# EAGLE board gator (EAGLE 6.3)
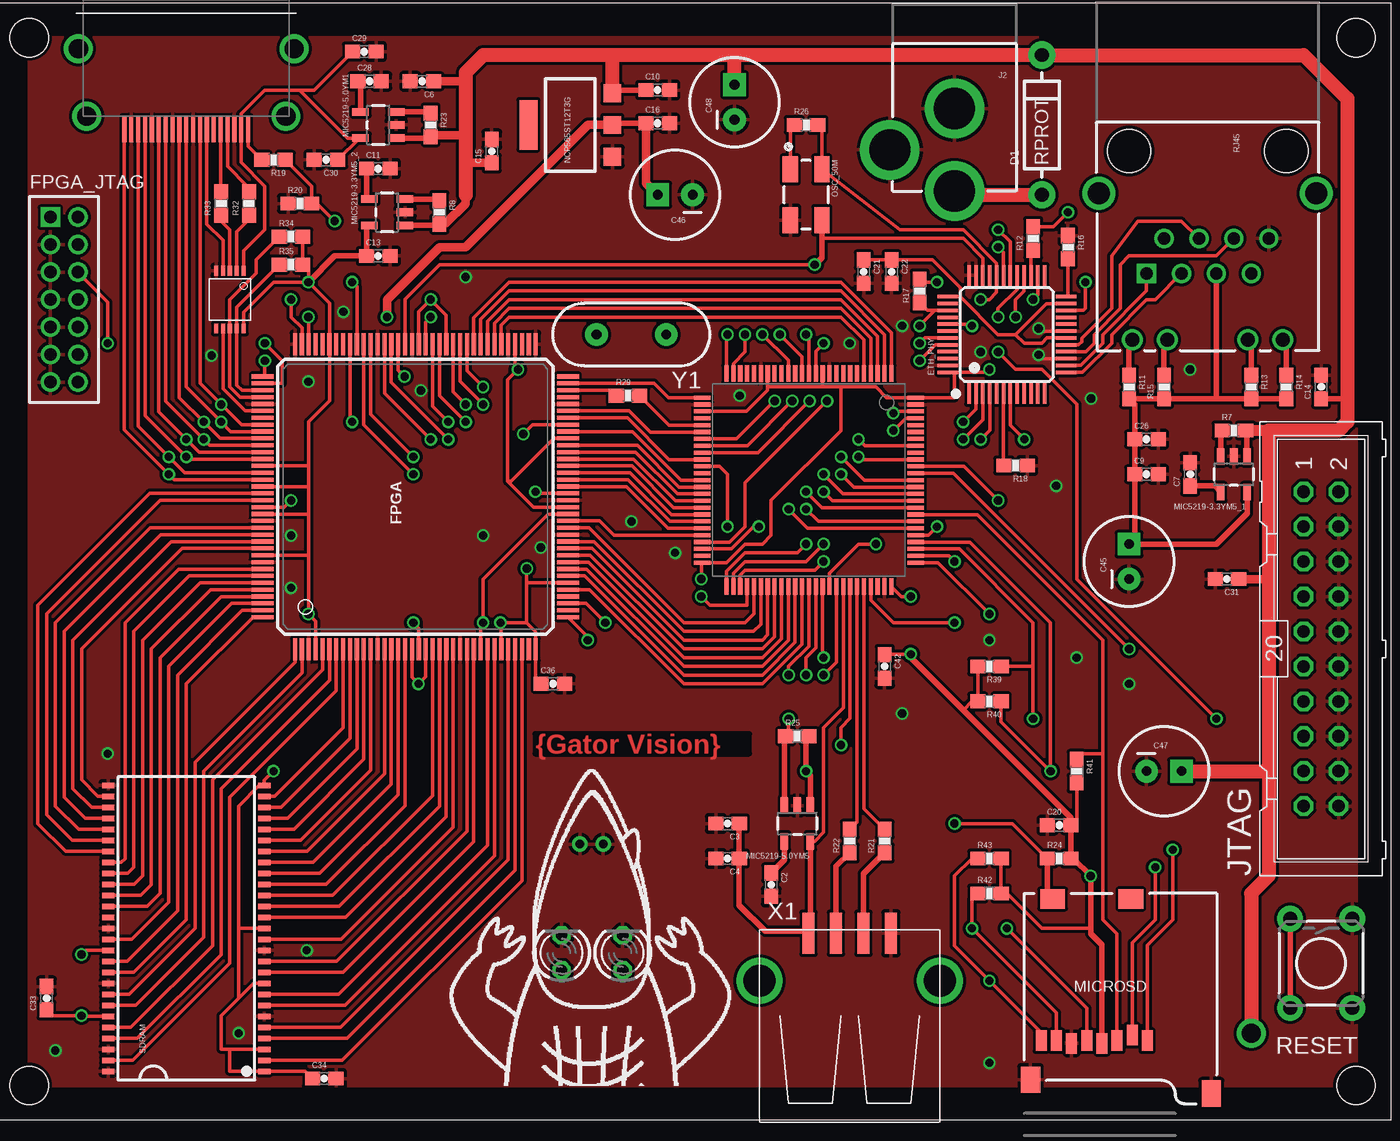
[diagram p2: board, top side]
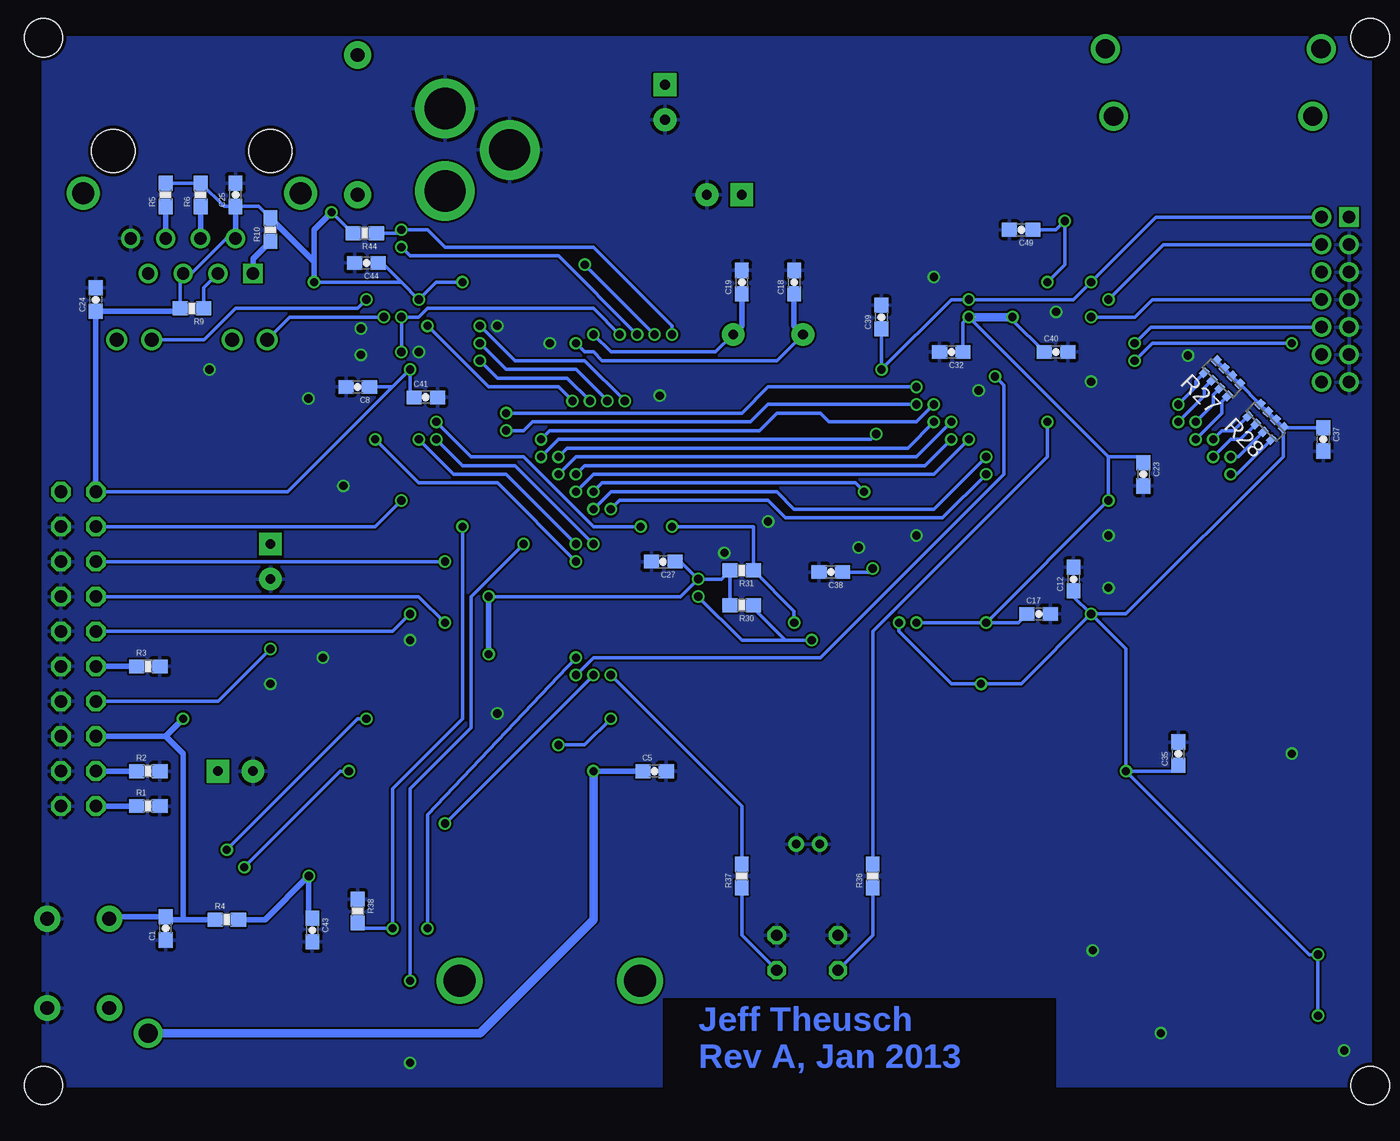
[diagram p3: board, bottom side, seen from below]

No outline drawn. Coordinates in mm, seen from the top.
Copper layers (1*16): Top 0.035mm / dielectric 1.5mm / Bottom 0.035mm
Design rules "Fusion_eagle_rule_v1.1": minimum track width 6mil, minimum drill 12mil, track to track 6mil, track to pad 6mil, pad to pad 6mil, via to via 6mil, smd to smd 0mil, copper to edge 10mil, drill to drill 10mil, minimum pad ring 10mil, minimum via ring 6mil, stop-mask expansion 2mil, vias tented up to drill 100mil, thermal gap 10mil
Holes 2.8 mm at 2.54,2.54 2.54,78.74 99.06,78.74 99.06,2.54

## Footprints (pad centres in the part's own frame; a part is rotated, then mirrored left to right if it is on the bottom)
0603-CAP = smd 1.1 x 1: 1 -0.85,0; 2 0.85,0
CPOL-RADIAL-100UF-25V = drill 0.7 pad 1.651 square: 1 1.27,0 | drill 0.7 pad 1.651: 2 -1.27,0
DIODE-1N4001 = drill 1 pad 1.981: A -5.08,0; C 5.08,0
LQFP-48 = smd 1.5 x 0.254: 1 -4.3,2.75; 2 -4.3,2.25; 3 -4.3,1.75; 4 -4.3,1.25; 5 -4.3,0.75; 6 -4.3,0.25; 7 -4.3,-0.25; 8 -4.3,-0.75; 9 -4.3,-1.25; 10 -4.3,-1.75; 11 -4.3,-2.25; 12 -4.3,-2.75; 25 4.3,-2.75; 26 4.3,-2.25; 27 4.3,-1.75; 28 4.3,-1.25; 29 4.3,-0.75; 30 4.3,-0.25; 31 4.3,0.25; 32 4.3,0.75; 33 4.3,1.25; 34 4.3,1.75; 35 4.3,2.25; 36 4.3,2.75 | smd 0.254 x 1.5: 13 -2.75,-4.3; 14 -2.25,-4.3; 15 -1.75,-4.3; 16 -1.25,-4.3; 17 -0.75,-4.3; 18 -0.25,-4.3; 19 0.25,-4.3; 20 0.75,-4.3; 21 1.25,-4.3; 22 1.75,-4.3; 23 2.25,-4.3; 24 2.75,-4.3; 37 2.75,4.3; 38 2.25,4.3; 39 1.75,4.3; 40 1.25,4.3; 41 0.75,4.3; 42 0.25,4.3; 43 -0.25,4.3; 44 -0.75,4.3; 45 -1.25,4.3; 46 -1.75,4.3; 47 -2.25,4.3; 48 -2.75,4.3
TQ144 = smd 1.6 x 0.3: P1 -11.1,8.75; P2 -11.1,8.25; P3 -11.1,7.75; P4 -11.1,7.25; P5 -11.1,6.75; P6 -11.1,6.25; P7 -11.1,5.75; P8 -11.1,5.25; P9 -11.1,4.75; P10 -11.1,4.25; P11 -11.1,3.75; P12 -11.1,3.25; P13 -11.1,2.75; P14 -11.1,2.25; P15 -11.1,1.75; P16 -11.1,1.25; P17 -11.1,0.75; P18 -11.1,0.25; P19 -11.1,-0.25; P20 -11.1,-0.75; P21 -11.1,-1.25; P22 -11.1,-1.75; P23 -11.1,-2.25; P24 -11.1,-2.75; P25 -11.1,-3.25; P26 -11.1,-3.75; P27 -11.1,-4.25; P28 -11.1,-4.75; P29 -11.1,-5.25; P30 -11.1,-5.75; P31 -11.1,-6.25; P32 -11.1,-6.75; P33 -11.1,-7.25; P34 -11.1,-7.75; P35 -11.1,-8.25; P36 -11.1,-8.75; P73 11.1,-8.75; P74 11.1,-8.25; P75 11.1,-7.75; P76 11.1,-7.25; P77 11.1,-6.75; P78 11.1,-6.25; P79 11.1,-5.75; P80 11.1,-5.25; P81 11.1,-4.75; P82 11.1,-4.25; P83 11.1,-3.75; P84 11.1,-3.25; P85 11.1,-2.75; P86 11.1,-2.25; P87 11.1,-1.75; P88 11.1,-1.25; P89 11.1,-0.75; P90 11.1,-0.25; P91 11.1,0.25; P92 11.1,0.75; P93 11.1,1.25; P94 11.1,1.75; P95 11.1,2.25; P96 11.1,2.75; P97 11.1,3.25; P98 11.1,3.75; P99 11.1,4.25; P100 11.1,4.75; P101 11.1,5.25; P102 11.1,5.75; P103 11.1,6.25; P104 11.1,6.75; P105 11.1,7.25; P106 11.1,7.75; P107 11.1,8.25; P108 11.1,8.75 | smd 0.3 x 1.6: P37 -8.75,-11.1; P38 -8.25,-11.1; P39 -7.75,-11.1; P40 -7.25,-11.1; P41 -6.75,-11.1; P42 -6.25,-11.1; P43 -5.75,-11.1; P44 -5.25,-11.1; P45 -4.75,-11.1; P46 -4.25,-11.1; P47 -3.75,-11.1; P48 -3.25,-11.1; P49 -2.75,-11.1; P50 -2.25,-11.1; P51 -1.75,-11.1; P52 -1.25,-11.1; P53 -0.75,-11.1; P54 -0.25,-11.1; P55 0.25,-11.1; P56 0.75,-11.1; P57 1.25,-11.1; P58 1.75,-11.1; P59 2.25,-11.1; P60 2.75,-11.1; P61 3.25,-11.1; P62 3.75,-11.1; P63 4.25,-11.1; P64 4.75,-11.1; P65 5.25,-11.1; P66 5.75,-11.1; P67 6.25,-11.1; P68 6.75,-11.1; P69 7.25,-11.1; P70 7.75,-11.1; P71 8.25,-11.1; P72 8.75,-11.1; P109 8.75,11.1; P110 8.25,11.1; P111 7.75,11.1; P112 7.25,11.1; P113 6.75,11.1; P114 6.25,11.1; P115 5.75,11.1; P116 5.25,11.1; P117 4.75,11.1; P118 4.25,11.1; P119 3.75,11.1; P120 3.25,11.1; P121 2.75,11.1; P122 2.25,11.1; P123 1.75,11.1; P124 1.25,11.1; P125 0.75,11.1; P126 0.25,11.1; P127 -0.25,11.1; P128 -0.75,11.1; P129 -1.25,11.1; P130 -1.75,11.1; P131 -2.25,11.1; P132 -2.75,11.1; P133 -3.25,11.1; P134 -3.75,11.1; P135 -4.25,11.1; P136 -4.75,11.1; P137 -5.25,11.1; P138 -5.75,11.1; P139 -6.25,11.1; P140 -6.75,11.1; P141 -7.25,11.1; P142 -7.75,11.1; P143 -8.25,11.1; P144 -8.75,11.1
87758-14 = drill 0.914 square: 1 -6,-1 | drill 0.914: 2 -6,1; 3 -4,-1; 4 -4,1; 5 -2,-1; 6 -2,1; 7 0,-1; 8 0,1; 9 2,-1; 10 2,1; 11 4,-1; 12 4,1; 13 6,-1; 14 6,1
POWER_JACK_PTH = drill 2.997 pad 4.318: GND 0,7.7; GNDBREAK 4.7,10.7; PWR 0,13.7
ML20 = drill 0.914 octagon: 1 -11.43,-1.27; 2 -11.43,1.27; 3 -8.89,-1.27; 4 -8.89,1.27; 5 -6.35,-1.27; 6 -6.35,1.27; 7 -3.81,-1.27; 8 -3.81,1.27; 9 -1.27,-1.27; 10 -1.27,1.27; 11 1.27,-1.27; 12 1.27,1.27; 13 3.81,-1.27; 14 3.81,1.27; 15 6.35,-1.27; 16 6.35,1.27; 17 8.89,-1.27; 18 8.89,1.27; 19 11.43,-1.27; 20 11.43,1.27
LED3MM = drill 0.813 octagon: A -1.27,0; K 1.27,0
LQFP-100 = smd 0.3 x 1.2: 1 1.15,-0.6; 2 1.65,-0.6; 3 2.15,-0.6; 4 2.65,-0.6; 5 3.15,-0.6; 6 3.65,-0.6; 7 4.15,-0.6; 8 4.65,-0.6; 9 5.15,-0.6; 10 5.65,-0.6; 11 6.15,-0.6; 12 6.65,-0.6; 13 7.15,-0.6; 14 7.65,-0.6; 15 8.15,-0.6; 16 8.65,-0.6; 17 9.15,-0.6; 18 9.65,-0.6; 19 10.15,-0.6; 20 10.65,-0.6; 21 11.15,-0.6; 22 11.65,-0.6; 23 12.15,-0.6; 24 12.65,-0.6; 25 13.15,-0.6; 51 13.15,14.9; 52 12.65,14.9; 53 12.15,14.9; 54 11.65,14.9; 55 11.15,14.9; 56 10.65,14.9; 57 10.15,14.9; 58 9.65,14.9; 59 9.15,14.9; 60 8.65,14.9; 61 8.15,14.9; 62 7.65,14.9; 63 7.15,14.9; 64 6.65,14.9; 65 6.15,14.9; 66 5.65,14.9; 67 5.15,14.9; 68 4.65,14.9; 69 4.15,14.9; 70 3.65,14.9; 71 3.15,14.9; 72 2.65,14.9; 73 2.15,14.9; 74 1.65,14.9; 75 1.15,14.9 | smd 1.2 x 0.3: 26 14.9,1.15; 27 14.9,1.65; 28 14.9,2.15; 29 14.9,2.65; 30 14.9,3.15; 31 14.9,3.65; 32 14.9,4.15; 33 14.9,4.65; 34 14.9,5.15; 35 14.9,5.65; 36 14.9,6.15; 37 14.9,6.65; 38 14.9,7.15; 39 14.9,7.65; 40 14.9,8.15; 41 14.9,8.65; 42 14.9,9.15; 43 14.9,9.65; 44 14.9,10.15; 45 14.9,10.65; 46 14.9,11.15; 47 14.9,11.65; 48 14.9,12.15; 49 14.9,12.65; 50 14.9,13.15; 76 -0.6,13.15; 77 -0.6,12.65; 78 -0.6,12.15; 79 -0.6,11.65; 80 -0.6,11.15; 81 -0.6,10.65; 82 -0.6,10.15; 83 -0.6,9.65; 84 -0.6,9.15; 85 -0.6,8.65; 86 -0.6,8.15; 87 -0.6,7.65; 88 -0.6,7.15; 89 -0.6,6.65; 90 -0.6,6.15; 91 -0.6,5.65; 92 -0.6,5.15; 93 -0.6,4.65; 94 -0.6,4.15; 95 -0.6,3.65; 96 -0.6,3.15; 97 -0.6,2.65; 98 -0.6,2.15; 99 -0.6,1.65; 100 -0.6,1.15
SOT23-5 = smd 0.55 x 1.2: 1 -0.95,-1.3; 2 0,-1.3; 3 0.95,-1.3; 4 0.95,1.3; 5 -0.95,1.3
MICRO-SD-SOCKET-PP = smd 0.8 x 1.5: 1 -8.94,10.7; 2 -7.84,10.3; 3 -6.74,10.7; 4 -5.64,10.9; 5 -4.54,10.7; 6 -3.44,10.9; 7 -2.34,10.7; 8 -1.24,10.7 | smd 1.8 x 1.4: CD1 -2.05,0.4; CD2 -7.75,0.4 | smd 1.4 x 1.9: GND1 -13.6,14.55; GND3 -0.45,13.55
SOT223-R = smd 1.3 x 1.3: 1 -2.3,-3.05; 2 0,-3.05; 3 2.3,-3.05 | smd 3.6 x 1.3: 4 0,3.05
CRYSTAL-OSC-SMD-5X3 = smd 1.9 x 1.1: 1 -1.85,-1.15; 2 1.85,-1.15; 3 1.85,1.15; 4 -1.85,1.15
0603-RES = smd 1.1 x 1: 1 -0.85,0; 2 0.85,0
0603-ARV = smd 0.5 x 0.65: 1 -1.2,-0.625; 2 -0.4,-0.625; 3 0.4,-0.625; 4 1.2,-0.625; 5 1.2,0.625; 6 0.4,0.625; 7 -0.4,0.625; 8 -1.2,0.625
TACTILE-PTH = drill 1.016 pad 1.88: 1 -3.251,2.261; 2 3.251,2.261; 3 -3.251,-2.261; 4 3.251,-2.261
MAGJACK-19938 = drill 0.9 square: 1 0,0 | drill 0.9: 2 -2.54,1.27; 3 0,2.54; 4 -2.54,3.81; 5 0,5.08; 6 -2.54,6.35; 7 0,7.62; 8 -2.54,8.89 | drill 1.02: 9 4.83,-1.02; 10 4.83,1.52; 11 4.83,7.37; 12 4.83,9.91 | drill 1.6: P$1 -5.84,-3.455; P$2 -5.84,12.345 | hole 3.15: -8.89,-1.27; -8.89,10.16
TSOP54-400 = smd 0.4 x 0.9: 1 -10.4,-5.68; 2 -9.6,-5.68; 3 -8.8,-5.68; 4 -8,-5.68; 5 -7.2,-5.68; 6 -6.4,-5.68; 7 -5.6,-5.68; 8 -4.8,-5.68; 9 -4,-5.68; 10 -3.2,-5.68; 11 -2.4,-5.68; 12 -1.6,-5.68; 13 -0.8,-5.68; 14 0,-5.68; 15 0.8,-5.68; 16 1.6,-5.68; 17 2.4,-5.68; 18 3.2,-5.68; 19 4,-5.68; 20 4.8,-5.68; 21 5.6,-5.68; 22 6.4,-5.68; 23 7.2,-5.68; 24 8,-5.68; 25 8.8,-5.68; 26 9.6,-5.68; 27 10.4,-5.68; 28 10.4,5.68; 29 9.6,5.68; 30 8.8,5.68; 31 8,5.68; 32 7.2,5.68; 33 6.4,5.68; 34 5.6,5.68; 35 4.8,5.68; 36 4,5.68; 37 3.2,5.68; 38 2.4,5.68; 39 1.6,5.68; 40 0.8,5.68; 41 0,5.68; 42 -0.8,5.68; 43 -1.6,5.68; 44 -2.4,5.68; 45 -3.2,5.68; 46 -4,5.68; 47 -4.8,5.68; 48 -5.6,5.68; 49 -6.4,5.68; 50 -7.2,5.68; 51 -8,5.68; 52 -8.8,5.68; 53 -9.6,5.68; 54 -10.4,5.68
HDMI_A_SMT = smd 1.9 x 0.3: P1 -4.76,4.5; P2 -4.76,4; P3 -4.76,3.5; P4 -4.76,3; P5 -4.76,2.5; P6 -4.76,2; P7 -4.76,1.5; P8 -4.76,1; P9 -4.76,0.5; P10 -4.76,0; P11 -4.76,-0.5; P12 -4.76,-1; P13 -4.76,-1.5; P14 -4.76,-2; P15 -4.76,-2.5; P16 -4.76,-3; P17 -4.76,-3.5; P18 -4.76,-4; P19 -4.76,-4.5 | drill 1.4: SH1 1.09,7.85; SH2 -3.81,7.25; SH3 -3.81,-7.25; SH4 1.09,-7.85
TSSOP10 = smd 0.7 x 0.3: 1 -2.1,1; 2 -2.1,0.5; 3 -2.1,0; 4 -2.1,-0.5; 5 -2.1,-1; 6 2.1,-1; 7 2.1,-0.5; 8 2.1,0; 9 2.1,0.5; 10 2.1,1
GATOR_HEAD = drill 0.6: L 9.449,17.556; R 11.156,17.556
USB-A-S = smd 3 x 0.9: D+ 3.45,-1; D- 3.45,1; GND 3.45,-3; VBUS 3.45,3 | drill 2.311: P$5 0,-6.566; P$6 0,6.566
HC49US = drill 0.7 pad 1.651: 1 -2.54,0; 2 2.54,0

## Placement (x,y rotation side)
C1  100n  [0603-CAP]  90.17,13.97 90 bottom
C2  470p  [0603-CAP]  56.52,17.14 270 top
C3  100n  [0603-CAP]  53.34,21.59 180 top
C4  10u  [0603-CAP]  53.34,19.05 180 top
C5  100n  [0603-CAP]  54.61,25.4 0 bottom
C6  10u  [0603-CAP]  31.11,75.56 180 top
C7  470p  [0603-CAP]  87,46.99 90 top
C8  100n  [0603-CAP]  76.2,53.34 180 bottom
C9  10u  [0603-CAP]  83.82,46.99 0 top
C10  100n  [0603-CAP]  48.26,74.93 0 top
C11  470p  [0603-CAP]  27.94,69.22 0 top
C12  100n  [0603-CAP]  24.13,39.37 90 bottom
C13  10u  [0603-CAP]  27.94,62.87 0 top
C14  100n  [0603-CAP]  96.52,53.34 90 top
C15  100n  [0603-CAP]  36.2,70.48 90 top
C16  10u  [0603-CAP]  48.26,72.52 0 top
C17  100n  [0603-CAP]  26.67,36.83 0 bottom
C18  20p  [0603-CAP]  44.45,60.96 90 bottom
C19  20p  [0603-CAP]  48.26,60.96 90 bottom
C20  10u  [0603-CAP]  77.47,21.46 0 top
C21  10u  [0603-CAP]  63.25,61.72 270 top
C22  100n  [0603-CAP]  65.28,61.72 270 top
C23  100n  [0603-CAP]  19.05,46.99 270 bottom
C24  100n  [0603-CAP]  95.25,59.69 90 bottom
C25  100n  [0603-CAP]  85.09,67.31 90 bottom
C26  100n  [0603-CAP]  83.82,49.53 0 top
C27  100n  [0603-CAP]  53.98,40.64 180 bottom
C28  470p  [0603-CAP]  27.3,75.56 0 top
C29  100n  [0603-CAP]  26.92,77.72 0 top
C30  10u  [0603-CAP]  24.13,69.85 180 top
C31  100n  [0603-CAP]  89.66,39.37 180 top
C32  100n  [0603-CAP]  33.02,55.88 180 bottom
C33  100n  [0603-CAP]  3.81,8.89 90 top
C34  100n  [0603-CAP]  24,3.05 0 top
C35  100n  [0603-CAP]  16.51,26.67 90 bottom
C36  100n  [0603-CAP]  40.64,31.75 0 top
C37  100n  [0603-CAP]  5.97,49.53 270 bottom
C38  100n  [0603-CAP]  41.78,39.88 180 bottom
C39  100n  [0603-CAP]  38.1,58.42 90 bottom
C40  100n  [0603-CAP]  25.4,55.88 0 bottom
C41  100n  [0603-CAP]  71.25,52.58 0 bottom
C42  100n  [0603-CAP]  64.77,33.02 270 top
C43  100n  [0603-CAP]  79.5,13.84 270 bottom
C44  100n  [0603-CAP]  75.56,62.36 180 bottom
C45  100u  [CPOL-RADIAL-100UF-25V]  82.55,40.64 90 top
C46  100u  [CPOL-RADIAL-100UF-25V]  49.53,67.31 180 top
C47  100u  [CPOL-RADIAL-100UF-25V]  85.09,25.4 0 top
C48  100u  [CPOL-RADIAL-100UF-25V]  53.85,74.04 90 top
C49  100n  [0603-CAP]  27.94,64.77 180 bottom
D1  RPROT  [DIODE-1N4001]  76.2,72.39 90 top
ETH_PHY  DP83848C  [LQFP-48]  73.66,57.15 90 top
FPGA  6SLX9TQG144  [TQ144]  30.63,45.35 90 top
FPGA_JTAG  87758-14  [87758-14]  5.08,59.69 270 top
J2  POWER_JACKPTH  [POWER_JACK_PTH]  69.85,81.28 180 top
JTAG  HEADER  [ML20]  96.52,34.29 270 top
LED_L_EYE  GRN  [LED3MM]  41.27,12.19 90 top
LED_R_EYE  GRN  [LED3MM]  45.72,12.19 90 top
MCU  STM32F417VGT6  [LQFP-100]  66.41,53.71 180 top
MIC5219-3.3YM5_1  3.3V  [SOT23-5]  90.17,46.99 180 top
MIC5219-3.3YM5_2  3.3V  [SOT23-5]  28.57,66.04 90 top
MIC5219-5.0YM1  5.0V  [SOT23-5]  27.94,72.39 90 top
MIC5219-5.0YM5  5.0V  [SOT23-5]  58.42,21.59 180 top
MICROSD  USD-SOCKETNEW  [MICRO-SD-SOCKET-PP]  74.93,16.51 180 top
NCP565ST12T3G  1.2V  [SOT223-R]  41.91,72.39 90 top
OSC_50M  OSCILLATOR5X3-PIN1-INDICATED  [CRYSTAL-OSC-SMD-5X3]  59.05,67.31 270 top
R1  10K  [0603-RES]  91.44,22.86 0 bottom
R2  10K  [0603-RES]  91.44,25.4 0 bottom
R3  10K  [0603-RES]  91.44,33.02 0 bottom
R4  10K  [0603-RES]  85.72,14.61 0 bottom
R5  51  [0603-RES]  90.17,67.31 90 bottom
R6  51  [0603-RES]  87.63,67.31 90 bottom
R7  10K  [0603-RES]  90.17,50.16 0 top
R8  10K  [0603-RES]  32.38,66.04 270 top
R9  51  [0603-RES]  88.27,59.05 180 bottom
R10  51  [0603-RES]  82.55,64.77 90 bottom
R11  2K2  [0603-RES]  82.55,53.34 270 top
R12  2K2  [0603-RES]  75.56,64.14 90 top
R13  2K2  [0603-RES]  91.44,53.34 270 top
R14  120  [0603-RES]  93.98,53.34 270 top
R15  120  [0603-RES]  85.09,53.34 90 top
R16  4K87  [0603-RES]  78.11,63.5 270 top
R17  2K2  [0603-RES]  67.31,60.33 90 top
R18  2K2  [0603-RES]  74.3,47.62 180 top
R19  4K7  [0603-RES]  20.32,69.85 180 top
R20  4K7  [0603-RES]  22.23,66.67 0 top
R21  22  [0603-RES]  64.77,20.32 90 top
R22  22  [0603-RES]  62.23,20.32 90 top
R23  10K  [0603-RES]  31.75,72.39 270 top
R24  10K  [0603-RES]  77.47,19.05 0 top
R25  10K  [0603-RES]  58.42,27.94 0 top
R26  10K  [0603-RES]  59.05,72.39 0 top
R27  51  [0603-ARV]  13.34,53.98 315 bottom
R28  51  [0603-ARV]  10.16,50.8 315 bottom
R29  51  [0603-RES]  46.1,52.7 0 top
R30  4K7  [0603-RES]  48.26,37.47 180 bottom
R31  4K7  [0603-RES]  48.26,40.01 180 bottom
R32  22  [0603-RES]  18.54,66.67 90 top
R33  22  [0603-RES]  16.51,66.67 90 top
R34  10K  [0603-RES]  21.59,64.26 0 top
R35  10K  [0603-RES]  21.59,62.23 0 top
R36  120  [0603-RES]  38.73,17.78 90 bottom
R37  120  [0603-RES]  48.26,17.78 90 bottom
R38  47K  [0603-RES]  76.2,15.24 270 bottom
R39  47K  [0603-RES]  72.39,33.02 180 top
R40  47K  [0603-RES]  72.39,30.48 180 top
R41  47K  [0603-RES]  78.74,25.4 270 top
R42  47K  [0603-RES]  72.39,16.51 0 top
R43  47K  [0603-RES]  72.39,19.05 0 top
R44  1K5  [0603-RES]  75.69,64.52 180 bottom
RESET  0  [TACTILE-PTH]  96.52,11.43 270 top
RJ45  MAGJACK-2  [MAGJACK-19938]  83.82,61.59 270 top
SDRAM  MT48LC16M16A2P  [TSOP54-400]  13.97,13.97 90 top
U$2  HDMI_A  [HDMI_A_SMT]  13.97,76.83 90 top
U$3  PCA9527  [TSSOP10]  17.14,59.69 270 top
U$4  GATOR_HEAD  [GATOR_HEAD]  33.15,2.54 0 top
X1  USB-A-S  [USB-A-S]  62.23,10.16 90 top
Y1  12MHz  [HC49US]  46.35,57.15 180 top

## Tracks (layer width: path | path; a pad name or v marks a point on that pad's centre or on a via)
50MHZ_OSC  (via drill 0.6)
  Top 0.254: MCU.24 53.76,55.03 54.61,55.88 v54.61,57.15 | FPGA.P92 29.88,59.73 32.38,62.23 v59.69,62.23 | ETH_PHY.34 71.91,62.71 70.48,64.14 60.2,64.14 60.2,63.5
  Top 0.406: OSC_50M.3 60.2,63.5 60.2,62.74 v59.69,62.23
  Bottom 0.254: v54.61,57.15 v59.69,62.23
+3V3  (via drill 0.6)
  Top 0.254: 60.26,53.34 61.59,53.34 | 61.59,53.34 64.14,53.34 64.91,52.56 MCU.100 69.85,52.56 69.85,54.4 | MCU.11 60.26,53.34 | 60.26,53.34 56.26,53.34 | 56.26,53.34 MCU.19 | 56.26,53.34 56.26,53.09 54.74,51.56 MCU.28 | MCU.75 65.97,38.1 v66.67,38.1 | v51.44,39.37 51.44,40.48 MCU.50 53.26,40.56 54.61,41.91 55.88,41.91 56.52,42.55 56.52,45.09 61.59,50.16 61.59,53.34 | ETH_PHY.22 79.22,58.9 79.38,59.05 v79.38,60.96 | v71.75,59.69 72.39,59.69 72.91,60.21 ETH_PHY.32 72.91,62.34 70.48,64.77 65.86,64.77 OSC_50M.4 60.2,72.09 R26.2 | ETH_PHY.48 69.85,54.4 | 69.85,54.4 72.18,54.4 v72.39,54.61 | R12.2 77.05,64.98 v78.11,66.04 | R17.2 67.53,60.96 v68.58,60.96 | C42.1 64.81,33.91 v66.67,33.91 | 79.76,13.97 76.2,13.97 73.66,16.51 R42.2 R43.2 | 70.48,29.84 71.12,30.48 R40.2 R39.2 | R41.2 78.74,21.88 C20.2
  Top 0.406: MIC5219-3.3YM5_1.5 91.15,45.72 91.15,44.16 88.9,41.91 C45.1 82.97,42.33 C9.1 C26.1 82.97,52.07 R11.2 R15.1 88.9,52.49 | 88.9,52.49 R13.2 R14.2 | RJ45.5 88.9,52.49 | v66.67,33.91 66.67,33.66 70.48,29.84 78.32,22.01 C20.2 R24.2 78.49,19.05 v79.76,17.78 79.76,13.97 79.76,13.59 80.57,12.78 MICROSD.4
  Bottom 0.254: v51.44,39.37 52.7,38.1 v66.67,38.1 | RJ45.2 85.72,64.14 88.27,61.59 RJ45.5 89.11,61.38 R9.2 | R5.2 R6.2 85.93,66.46 C25.1 83.39,66.46 R10.2 | v79.38,60.96 73.03,60.96 | 73.03,60.96 v71.75,59.69 70.48,60.96 v68.58,60.96 | 73.66,53.34 v72.39,54.61 72.39,52.87 C41.1 | 73.66,53.34 81.28,45.72 JTAG.1 | R30.2 R31.2 49.74,39.37 v51.44,39.37 | C8.1 73.66,53.34 | C27.1 52.7,40.64 v51.44,39.37 | C44.1 74.42,62.36 73.03,60.96 | R44.2 76.58,64.52 v78.11,66.04
  Bottom 0.406: v66.67,33.91 v66.67,38.1 | RJ45.2 C25.1 | R9.2 89.33,58.84 C24.1 JTAG.1 | R4.2 82.93,14.61 v79.76,17.78 79.76,14.95 C43.1 | v79.38,60.96 79.38,62.45 | 79.38,62.45 R10.2 | 79.38,62.45 79.38,64.77 v78.11,66.04
/TRST  (via drill 0.6)
  Top 0.254: MCU.90 70.55,47.56 v73.03,45.09
  Bottom 0.254: v73.03,45.09 74.93,43.18 JTAG.3
A16
  Top 0.254: FPGA.P46 43.36,41.1 50.16,34.29 55.88,34.29 56.76,35.17 MCU.58
A17
  Top 0.254: MCU.59 57.26,35.04 55.88,33.66 50.16,33.66 43.22,40.6 FPGA.P45
A18
  Top 0.254: FPGA.P44 43.09,40.1 50.16,33.02 55.88,33.02 57.76,34.9 MCU.60
A19
  Top 0.254: MCU.2 64.77,57.15 61.59,60.33 37.47,60.33 35.38,58.24 FPGA.P81
A20
  Top 0.254: MCU.3 64.26,57.02 61.59,59.69 37.47,59.69 35.88,58.11 FPGA.P80
A21
  Top 0.254: MCU.4 63.76,56.89 61.59,59.05 37.47,59.05 36.38,57.97 FPGA.P79
A22
  Top 0.254: MCU.5 63.26,56.75 61.59,58.42 37.47,58.42 36.88,57.84 FPGA.P78
A23
  Top 0.254: MCU.1 65.26,57.29 61.59,60.96 37.47,60.96 34.88,58.38 FPGA.P82
CEC
  Top 0.254: U$3.4 16.64,64 15.47,65.17 U$2.P13
CEC_INT
  Top 0.254: U$3.7 16.64,53.2 18.25,51.6 FPGA.P114
CFG_CLK
  Top 0.254: MCU.30 49.09,50.56 R29.2
CFG_DIN  (via drill 0.6)
  Top 0.254: v62.87,48.26 63.06,48.06 MCU.91 | v38.48,49.91 39.17,50.6 FPGA.P65
  Bottom 0.254: v62.87,48.26 61.59,49.53 38.86,49.53 v38.48,49.91
D0
  Top 0.254: FPGA.P43 42.95,39.6 50.16,32.38 55.88,32.38 58.26,34.77 MCU.61
D1
  Top 0.254: FPGA.P41 43.32,38.6 50.16,31.75 55.88,31.75 58.76,34.63 MCU.62
D2  (via drill 0.6)
  Top 0.254: v30.48,46.99 26.88,50.59 FPGA.P98 | v57.78,44.45 59.17,43.06 MCU.81
  Bottom 0.254: v30.48,46.99 33.66,43.81 45.09,43.81 46.35,45.09 57.15,45.09 v57.78,44.45
D3  (via drill 0.6)
  Top 0.254: v30.48,48.26 27.38,51.36 FPGA.P97 | v59.05,44.45 59.94,43.56 MCU.82
  Bottom 0.254: v30.48,48.26 34.29,44.45 44.45,44.45 45.72,45.72 57.78,45.72 v59.05,44.45
D4
  Top 0.254: MCU.38 49.96,46.56 46.42,50.1 FPGA.P64
D5
  Top 0.254: MCU.39 49.82,46.06 46.79,49.1 FPGA.P62
D6
  Top 0.254: MCU.40 49.69,45.56 46.65,48.6 FPGA.P61
D7
  Top 0.254: MCU.41 49.55,45.06 46.52,48.1 FPGA.P60
D8
  Top 0.254: MCU.42 49.42,44.56 46.38,47.6 FPGA.P59
D9
  Top 0.254: MCU.43 49.28,44.06 46.25,47.1 FPGA.P58
D10
  Top 0.254: MCU.44 49.15,43.56 46.11,46.6 FPGA.P57
D11
  Top 0.254: MCU.45 49.01,43.06 45.98,46.1 FPGA.P56
D12
  Top 0.254: FPGA.P51 44.03,43.6 45.07,42.56 MCU.46
D13
  Top 0.254: MCU.55 55.26,36.85 54.61,36.2 50.16,36.2 43.26,43.1 FPGA.P50
D14
  Top 0.254: FPGA.P48 43.63,42.1 50.16,35.56 55.24,35.56 55.76,36.08 MCU.56
D15
  Top 0.254: FPGA.P47 43.49,41.6 50.16,34.92 55.88,34.92 56.26,35.31 MCU.57
DBGACK
  Bottom 0.406: JTAG.19 R1.1
DBGRQ
  Bottom 0.406: JTAG.17 R2.1
DDC_CLK
  Top 0.254: R33.2 16.47,66.93 U$2.P15
DDC_DATA
  Top 0.254: R32.2 18.41,67.94 16.97,69.39 U$2.P16
DDCC_INT
  Top 0.254: R34.1 19.05,62.57 19.05,61.59 17.14,59.69 U$3.8 17.14,53.34 17.89,52.6 FPGA.P112
DDCD_INT
  Top 0.254: R35.1 17.64,59.13 U$3.9 17.64,53.48 18.02,53.1 FPGA.P111
DONE
  Top 0.254: FPGA.P71 48,53.6 49.04,52.56 MCU.26
FPGA_CLK1  (via drill 0.6)
  Top 0.254: MCU.67 61.26,33.32 v60.33,32.38 | FPGA.P93 29.38,54.56 v29.84,54.1
  Bottom 0.254: v60.33,32.38 59.05,33.66 42.55,33.66 29.21,46.99 29.21,53.47 v29.84,54.1
FPGA_TCK  (via drill 0.6)
  Top 0.254: FPGA_JTAG.6 8.26,59.52 v8.26,56.52 | v19.68,55.24 19.68,54.25 FPGA.P109
  Bottom 0.254: v8.26,56.52 18.41,56.52 v19.68,55.24
FPGA_TDI  (via drill 0.6)
  Top 0.254: v19.68,56.52 20.95,55.24 20.95,53.6 FPGA.P110
  Bottom 0.254: FPGA_JTAG.10 18.51,57.69 v19.68,56.52
FPGA_TDO  (via drill 0.6)
  Top 0.254: FPGA.P106 22.88,58.4 v22.86,58.42
  Bottom 0.254: FPGA_JTAG.8 18.41,59.69 19.68,58.42 v22.86,58.42
FPGA_TMS  (via drill 0.6)
  Top 0.254: FPGA.P107 22.38,57.63 21.59,58.42 v21.59,59.69
  Bottom 0.254: FPGA_JTAG.4 17.59,63.69 v21.59,59.69
FSMC_CLK  (via drill 0.6)
  Top 0.254: MCU.84 60.21,44.56 v59.05,45.72 | FPGA.P55 39.49,45.6 v39.37,45.72
  Bottom 0.254: v59.05,45.72 58.42,46.35 40.01,46.35 v39.37,45.72
GND  (via drill 0.6)
  Top 0.254: ETH_PHY.19 76.15,57.4 v75.97,57.58 | ETH_PHY.15 76.25,55.4 v75.97,55.68
  other vias: 8.26,26.67 39.75,41.66 49.53,41.27 35.56,42.55 21.59,38.73 21.59,42.55 31.04,53.09 66.04,57.78 62.23,56.52 46.35,43.56 66.04,29.59 72.39,4.19 34.29,61.34 79.78,52.5 77.24,46.15 71.75,55.88 87,54.61 78.74,33.66 72.39,34.92 82.55,31.75 15.81,55.63 25.4,58.8 54.23,52.7 22.86,53.72 17.78,6.35 4.45,5.08 22.73,12.37
  pour Top (isolate 0.216): 2.54,78.74 99.06,78.74 99.06,2.54 2.54,2.54
  pour Bottom: 2.54,78.74 2.54,2.54 99.06,2.54 99.06,78.74
HDMI_5V
  Top 0.254: U$3.1 18.14,63.23 19.68,64.77 19.68,67.94 17.97,69.66 U$2.P18 17.97,73.22 19.68,74.93 22.23,74.93 | 22.23,74.93 25.71,71.44 MIC5219-5.0YM1.5 26.57,71.44 C30.1 | 22.23,74.93 23.28,74.93 C29.1
HDMI_DETECT  (via drill 0.6)
  Top 0.254: R19.1 23.07,67.94 R20.2 23.5,66.67 v24.77,65.41 | v26.04,60.96 26.38,60.61 FPGA.P99
  Bottom 0.254: v26.04,60.96 24.77,62.23 v24.77,65.41 25.4,64.77 C49.1
INIT_B  (via drill 0.6)
  Top 0.254: MCU.36 52.77,47.56 53.34,46.99 v53.34,43.18 | FPGA.P39 43.05,37.6 v44.45,36.2
  Bottom 0.254: v53.34,43.18 47.41,43.18 R31.1 44.45,37.05 v44.45,36.2
LED_ACT  (via drill 0.6)
  Top 0.254: v75.56,59.69 75.91,60.03 ETH_PHY.26
  Top 0.406: R13.1 91.44,56.52 RJ45.11
  Bottom 0.254: v75.56,59.69 76.2,59.05 85.09,59.05 87.38,56.77 RJ45.11
LED_LEFT  (via drill 0.6)
  Top 0.254: FPGA.P100 25.88,50.95 v26.04,50.8
  Bottom 0.254: 26.04,50.16 v26.04,50.8 26.04,48.26 38.73,35.56 R36.2
LED_LINK  (via drill 0.6)
  Top 0.254: v74.3,58.42 74.3,59.69 74.91,60.3 ETH_PHY.28
  Top 0.406: R11.1 82.55,56.52 RJ45.9
  Bottom 0.254: RJ45.9 81.14,58.42 v74.3,58.42
LED_RIGHT  (via drill 0.6)
  Top 0.254: MCU.63 59.26,34.5 57.78,33.02 v57.78,32.38
  Bottom 0.254: v57.78,32.38 48.26,22.86 R37.2
MII_INT  (via drill 0.6)
  Top 0.254: MCU.53 54.26,39.66 54.61,40.01 59.69,40.01 v60.33,40.64 | ETH_PHY.7 73.91,50.55 v74.93,49.53
  Bottom 0.254: v60.33,40.64 66.04,46.35 71.75,46.35 v74.93,49.53
MII_MDC  (via drill 0.6)
  Top 0.254: v73.03,63.5 73.41,63.12 ETH_PHY.31 | MCU.16 57.76,55.27 v55.88,57.15
  Bottom 0.254: v73.03,63.5 72.39,62.87 61.59,62.87 v55.88,57.15
MII_MDIO  (via drill 0.6)
  Top 0.254: v73.03,64.77 73.91,63.88 ETH_PHY.30 | MCU.25 53.26,57.07 v53.34,57.15
  Bottom 0.254: v53.34,57.15 53.34,57.78 59.05,63.5 69.85,63.5 71.12,64.77 v73.03,64.77 73.28,64.52 R44.1
MII_RX_ER  (via drill 0.6)
  Top 0.254: v71.12,57.78 71,57.9 ETH_PHY.41 | MCU.47 53.49,42.06 54.61,43.18 54.61,46.35 v60.58,52.32
  Bottom 0.254: v71.12,57.78 66.67,53.34 61.59,53.34 v60.58,52.32
MII_RXD0  (via drill 0.6)
  Top 0.254: v67.31,56.52 67.69,56.9 ETH_PHY.43 | MCU.33 54.78,49.06 v58.04,52.32
  Bottom 0.254: v67.31,56.52 65.41,54.61 60.33,54.61 v58.04,52.32
MII_RXD1  (via drill 0.6)
  Top 0.254: v67.31,55.24 68.47,56.4 ETH_PHY.44 | MCU.34 55.55,48.56 v59.31,52.32
  Bottom 0.254: v67.31,55.24 66.04,53.98 60.96,53.98 v59.31,52.32
MII_TX_EN  (via drill 0.6)
  Top 0.254: v70.48,50.8 71.41,51.73 ETH_PHY.2 | MCU.48 53.63,41.56 55.24,43.18 v55.63,43.18
  Bottom 0.254: v70.48,50.8 67.94,48.26 64.14,48.26 59.05,43.18 v55.63,43.18
MII_TXD0  (via drill 0.6)
  Top 0.254: v70.48,49.53 71.91,50.95 ETH_PHY.3 | MCU.51 53.26,39.93 54.61,41.27 58.42,41.27 v59.05,41.91
  Bottom 0.254: v59.05,41.91 64.77,47.62 68.58,47.62 v70.48,49.53
MII_TXD1  (via drill 0.6)
  Top 0.254: v71.75,49.53 72.41,50.19 ETH_PHY.4 | MCU.52 53.76,39.79 54.61,40.64 59.05,40.64 v60.33,41.91
  Bottom 0.254: v60.33,41.91 65.41,46.99 69.22,46.99 v71.75,49.53
N$1
  Top 0.254: R21.2 63.26,22.68 MCU.71
N$2
  Top 0.254: R22.2 62.76,21.7 MCU.70
N$3
  Top 1.016: J2.PWR 70.12,67.31 D1.A
N$4
  Top 0.406: MIC5219-5.0YM5.4 57.47,18.95 C2.1
N$5
  Top 0.406: MIC5219-3.3YM5_1.3 89.22,50.06 R7.1
N$7
  Top 0.406: MIC5219-3.3YM5_1.4 88.77,46.14 C7.1
N$8
  Top 0.406: R8.1 32.28,66.99 MIC5219-3.3YM5_2.3
N$9
  Top 0.254: U$3.2 17.64,64.64 18.41,65.41 R32.1
N$10
  Top 0.254: U$3.3 17.14,64.77 16.51,65.41 R33.1
N$11
  Bottom 0.254: R36.1 38.73,13.46 LED_L_EYE.A
N$12
  Bottom 0.254: R37.1 48.26,13.46 LED_R_EYE.A
N$13
  Top 0.406: R14.1 93.98,56.52 RJ45.12
N$14
  Top 0.406: R15.2 85.09,56.52 RJ45.10
N$15
  Top 0.406: MIC5219-5.0YM1.4 26.64,75.38 C28.1
N$16
  Top 0.254: ETH_PHY.24 78.11,60.05 R16.2
N$17
  Top 0.254: ETH_PHY.27 75.41,63.13 R12.1
N$18
  Top 0.254: ETH_PHY.6 73.41,47.66 R18.2
N$19
  Top 0.406: X1.D+ 63.23,17.93 R21.1
N$20
  Top 0.406: X1.D- 61.23,18.47 R22.1
N$21
  Top 0.406: R23.1 31.65,73.34 MIC5219-5.0YM1.3
N$22
  Top 0.254: U$2.P19 18.47,70.85 R19.2
N$29  (via drill 0.6)
  Top 0.254: MCU.12 59.76,55.95 v60.33,56.52
  Bottom 0.254: Y1.2 45.72,55.24 58.42,55.24 59.05,55.88 59.69,55.88 v60.33,56.52
  Bottom 0.406: Y1.2 44.45,57.78 C18.1
N$30  (via drill 0.6)
  Top 0.254: MCU.13 59.26,56.94 v59.05,57.15
  Bottom 0.254: Y1.1 50.16,55.88 57.78,55.88 v59.05,57.15
  Bottom 0.406: Y1.1 48.26,57.78 C19.1
N$31
  Top 0.254: R26.1 57.91,72.09 OSC_50M.1
N$32
  cutout Bottom: 25.4,2.54 25.4,8.89 53.98,8.89 53.98,2.54
N$33
  Top 0.254: R29.1 44.86,53.1 FPGA.P70
N$34
  Top 0.406: MIC5219-3.3YM5_2.4 27.09,67.17 C11.1
NBL0  (via drill 0.6)
  Top 0.254: FPGA.P84 33.88,53.75 v35.56,52.07 | v65.41,50.16 66.3,51.06 MCU.97
  Bottom 0.254: v65.41,50.16 64.14,50.16 63.5,50.8 47.62,50.8 46.35,52.07 v35.56,52.07
NBL1  (via drill 0.6)
  Top 0.254: FPGA.P83 34.38,54.52 v35.56,53.34 | v65.41,51.44 65.53,51.56 MCU.98
  Bottom 0.254: v65.41,51.44 48.26,51.44 46.35,53.34 v35.56,53.34
NE1  (via drill 0.6)
  Top 0.254: FPGA.P87 32.38,52.71 v34.29,50.8 | v61.59,48.26 63.29,46.56 MCU.88
  Bottom 0.254: v34.29,50.8 36.2,48.9 60.96,48.9 v61.59,48.26
NL  (via drill 0.6)
  Top 0.254: FPGA.P85 33.38,52.98 v34.29,52.07 | v62.87,49.53 63.33,49.06 MCU.93
  Bottom 0.254: v34.29,52.07 35.56,50.8 41.91,50.8 42.55,51.44 45.72,51.44 46.99,50.16 62.23,50.16 v62.87,49.53
NOE  (via drill 0.6)
  Top 0.254: v31.75,49.53 28.38,52.9 FPGA.P95 | v60.33,45.72 60.98,45.06 MCU.85
  Bottom 0.254: v31.75,49.53 34.29,46.99 59.05,46.99 v60.33,45.72
NRST  (via drill 0.6)
  Top 0.254: ETH_PHY.29 74.41,60.44 73.03,59.05 v73.03,58.42 | MCU.14 58.76,55.54 v57.15,57.15 | v88.9,29.21 78.74,39.37 78.74,52.07 76.2,54.61 74.3,54.61 v73.03,55.88
  Top 0.305: 94.12,8.18 RESET.4
  Top 0.406: RESET.4 RESET.3
  Bottom 0.254: v57.15,57.15 59.05,59.05 71.12,59.05 71.75,58.42 v73.03,58.42 v73.03,55.88
  Bottom 0.406: RESET.3 94.12,14.82 C1.2 89.95,14.61 88.9,14.61 | R4.1 88.9,14.61 | JTAG.15 90.17,27.94 | 90.17,27.94 88.9,26.67 88.9,14.61 | v88.9,29.21 90.17,27.94
NWAIT  (via drill 0.6)
  Top 0.254: FPGA.P88 31.88,51.94 v33.02,50.8 | v61.59,46.99 62.52,46.06 MCU.87
  Bottom 0.254: v33.02,50.8 35.56,48.26 60.33,48.26 v61.59,46.99
NWE  (via drill 0.6)
  Top 0.254: v33.02,49.53 28.88,53.67 FPGA.P94 | v60.33,46.99 61.75,45.56 MCU.86
  Bottom 0.254: v33.02,49.53 34.92,47.62 59.69,47.62 v60.33,46.99
PFB
  Top 0.254: ETH_PHY.23 76.55,59.4 74.3,57.15 | ETH_PHY.37 70.28,59.9 | 70.28,59.9 73.03,57.15 74.3,57.15 | 74.3,57.15 74.93,56.52 76.2,56.52 76.58,56.9 ETH_PHY.18 | C21.1 C22.1 68.24,62.57 70.28,60.53 70.28,59.9
PROGRAM_B  (via drill 0.6)
  Top 0.254: v51.44,38.1 52.07,37.47 54.76,37.47 MCU.54 | FPGA.P37 43.18,35.15 v43.18,34.92
  Bottom 0.254: R30.1 47.41,37.25 45.09,34.92 | 45.09,34.92 v43.18,34.92 | v51.44,38.1 48.26,34.92 45.09,34.92
RD+
  Top 0.254: ETH_PHY.14 79.03,54.9 80.64,56.52 80.64,57.15 83.82,60.33 RJ45.1
  Bottom 0.406: R10.1 83.82,62.65 RJ45.1
RD-
  Top 0.254: ETH_PHY.13 79.17,54.4 81.28,56.52 81.28,57.15 83.82,59.69 84.45,59.69 RJ45.3
  Bottom 0.254: RJ45.3 87.42,60.54 R9.1
RMII_CRSDV  (via drill 0.6)
  Top 0.254: v67.31,57.78 68.42,58.9 ETH_PHY.39 67.89,58.9 R17.1 | MCU.32 54.01,49.56 v56.77,52.32
  Bottom 0.254: v67.31,57.78 64.77,55.24 60.96,55.24 60.81,55.24 59.69,55.24 v56.77,52.32
RTCK
  Bottom 0.406: JTAG.11 R3.1
SD_CLK  (via drill 0.6)
  Top 0.254: MCU.80 67.96,42.56 v68.58,43.18 | MICROSD.5 79.47,8.16 v73.66,13.97
  Bottom 0.254: v68.58,43.18 68.58,29.21 73.66,24.13 v73.66,13.97 75.78,13.97 R38.2
SD_CMD
  Top 0.254: MICROSD.3 81.67,13.58 80.64,14.61 80.64,26.67 | 80.64,26.67 80.64,34.92 71.51,44.06 MCU.83 | R41.1 79.16,26.67 80.64,26.67
SD_D0  (via drill 0.6)
  Top 0.254: MICROSD.7 77.27,7.82 v71.12,13.97 71.12,16.09 R42.1 | MCU.65 60.26,33.72 v60.33,33.66
  Bottom 0.254: v60.33,33.66 71.12,22.23 v71.12,13.97
SD_D1  (via drill 0.6)
  Top 0.254: MICROSD.8 76.17,6.38 v72.39,10.16 69.85,12.7 69.85,17.78 71.12,19.05 R43.1 | MCU.66 60.76,39.81 62.87,41.91 v64.14,41.91
  Bottom 0.254: v72.39,10.16 72.39,24.13 67.94,28.57 67.94,38.1 v64.14,41.91
SD_D2  (via drill 0.6)
  Top 0.254: MICROSD.1 83.87,12.75 85.72,14.61 v85.72,19.68 | MCU.78 70.2,41.56 75.56,36.2 75.56,33.02 | 75.56,33.02 v75.56,29.21 | R39.1 75.56,33.02
  Bottom 0.254: v85.72,19.68 76.2,29.21 v75.56,29.21
SD_D3  (via drill 0.6)
  Top 0.254: MICROSD.2 82.77,12.92 84.45,14.61 v84.45,18.41 | MCU.79 70.97,42.06 76.83,36.2 v76.83,25.4 73.24,29 R40.1
  Bottom 0.254: v84.45,18.41 77.47,25.4 v76.83,25.4
SD_DETECT  (via drill 0.6)
  Top 0.254: v59.05,32.38 59.05,33.66 59.76,34.36 MCU.64 | v69.85,21.59 74.08,21.59 R24.1
  Top 0.305: 76.96,16.09 MICROSD.CD1
  Top 0.406: MICROSD.CD1 76.62,16.47 R24.1
  Bottom 0.254: v59.05,32.38 v69.85,21.59
SDR_A0
  Top 0.254: SDRAM.23 21.8,21.17 26.88,26.25 FPGA.P11
SDR_A1
  Top 0.254: SDRAM.24 21.34,21.97 26.38,27.02 FPGA.P10
SDR_A2
  Top 0.254: SDRAM.25 20.86,22.77 25.88,27.79 FPGA.P9
SDR_A3
  Top 0.254: SDRAM.26 20.39,23.57 25.38,28.56 FPGA.P8
SDR_A4
  Top 0.254: SDRAM.29 7.54,23.57 6.35,24.77 6.35,34.29 13.66,41.6 FPGA.P134
SDR_A5
  Top 0.254: SDRAM.30 7.08,22.77 5.71,24.13 5.71,34.92 12.89,42.1 FPGA.P133
SDR_A6
  Top 0.254: SDRAM.31 6.61,21.97 5.08,23.5 5.08,35.56 12.12,42.6 FPGA.P132
SDR_A7
  Top 0.254: SDRAM.32 6.13,21.17 4.45,22.86 4.45,36.2 11.35,43.1 FPGA.P131
SDR_A8
  Top 0.254: SDRAM.33 5.67,20.37 3.81,22.23 3.81,36.83 12.08,45.1 FPGA.P127
SDR_A9
  Top 0.254: SDRAM.34 5.2,19.57 3.17,21.59 3.17,37.47 11.31,45.6 FPGA.P126
SDR_A10
  Top 0.254: SDRAM.22 22.27,20.37 27.38,25.48 FPGA.P12
SDR_A11
  Top 0.254: SDRAM.35 9.24,18.77 9.53,19.05 9.53,36.2 13.43,40.1 FPGA.P137
SDR_A12
  Top 0.254: SDRAM.36 9.71,17.97 10.16,18.41 10.16,35.56 14.2,39.6 FPGA.P138
SDR_BA0
  Top 0.254: SDRAM.20 23.21,18.77 28.88,24.44 FPGA.P15
SDR_BA1
  Top 0.254: SDRAM.21 22.75,19.57 28.38,25.21 FPGA.P14
SDR_CAS
  Top 0.254: SDRAM.17 24.62,16.37 31.88,23.63 FPGA.P21
SDR_CKE
  Top 0.254: SDRAM.37 10.19,17.17 10.79,17.78 10.79,34.92 14.97,39.1 FPGA.P139
SDR_CLK
  Top 0.254: SDRAM.38 10.65,16.37 11.43,17.14 11.43,34.29 15.74,38.6 FPGA.P140
SDR_CS
  Top 0.254: SDRAM.19 23.68,17.97 29.38,23.67 FPGA.P16
SDR_DQ0
  Top 0.254: SDRAM.2 25.32,4.37 38.38,17.43 FPGA.P34
SDR_DQ1
  Top 0.254: SDRAM.4 25.66,5.97 37.88,18.2 FPGA.P33
SDR_DQ2
  Top 0.254: SDRAM.5 25.18,6.77 37.38,18.97 FPGA.P32
SDR_DQ3
  Top 0.254: SDRAM.7 25.52,8.37 36.38,19.24 FPGA.P30
SDR_DQ4
  Top 0.254: SDRAM.8 25.05,9.17 35.88,20.01 FPGA.P29
SDR_DQ5
  Top 0.254: SDRAM.10 25.38,10.77 34.88,20.28 FPGA.P27
SDR_DQ6
  Top 0.254: SDRAM.11 24.91,11.57 34.38,21.05 FPGA.P26
SDR_DQ7
  Top 0.254: SDRAM.13 25.23,13.17 33.38,21.32 FPGA.P24
SDR_DQ8
  Top 0.254: SDRAM.42 9.99,13.17 12.7,15.88 12.7,33.02 17.28,37.6 FPGA.P142
SDR_DQ9
  Top 0.254: SDRAM.44 9.66,11.57 13.34,15.24 13.34,32.38 18.05,37.1 FPGA.P143
SDR_DQ10
  Top 0.254: SDRAM.45 10.13,10.77 13.97,14.61 13.97,31.75 18.82,36.6 FPGA.P144
SDR_DQ11
  Top 0.254: SDRAM.47 9.8,9.17 14.61,13.97 14.61,26.04 21.88,33.31 FPGA.P1
SDR_DQ12
  Top 0.254: SDRAM.48 10.28,8.37 15.24,13.34 15.24,25.4 22.38,32.54 FPGA.P2
SDR_DQ13
  Top 0.254: SDRAM.50 9.95,6.77 15.88,12.7 15.88,24.77 23.88,32.77 FPGA.P5
SDR_DQ14
  Top 0.254: SDRAM.51 10.41,5.97 16.51,12.06 16.51,24.13 24.38,32 FPGA.P6
SDR_DQ15
  Top 0.254: SDRAM.53 10.09,4.37 17.14,11.43 17.14,23.5 24.88,31.23 FPGA.P7
SDR_DQMH
  Top 0.254: SDRAM.39 11.12,15.57 12.06,16.51 12.06,33.66 16.51,38.1 FPGA.P141
SDR_DQML
  Top 0.254: SDRAM.15 25.57,14.77 32.88,22.09 FPGA.P23
SDR_RAS
  Top 0.254: SDRAM.18 24.16,17.17 29.88,22.9 FPGA.P17
SDR_WE
  Top 0.254: SDRAM.16 25.09,15.57 32.38,22.86 FPGA.P22
SPI_MISO
  Top 0.254: FPGA.P67 46.19,51.6 47.73,50.06 MCU.31
TCK/SWCLK  (via drill 0.6)
  Top 0.254: MCU.76 68.66,40.56 v72.39,36.83
  Bottom 0.254: v72.39,36.83 73.66,35.56 JTAG.9
TD+
  Top 0.254: RJ45.4 86.36,65.41 83.19,65.41 81.28,62.87 81.28,59.05 79.12,56.9 79.12,56.64 78.88,56.4 ETH_PHY.17
  Bottom 0.406: R6.1 RJ45.4
TD-
  Top 0.254: ETH_PHY.16 79.39,55.9 80.01,56.52 80.01,57.15 81.92,59.05 81.92,62.23 82.55,62.87 88.9,62.87 RJ45.6
  Bottom 0.406: R5.1 RJ45.6
TDI  (via drill 0.6)
  Top 0.254: MCU.77 69.43,41.06 v69.85,40.64
  Bottom 0.254: v69.85,40.64 JTAG.5
TDO/SWO  (via drill 0.6)
  Top 0.254: MCU.89 69.78,47.06 v82.55,34.29
  Bottom 0.254: JTAG.13 86.36,30.48 v82.55,34.29
TMDS_CLKN  (via drill 0.6)
  Top 0.254: FPGA.P116 17.98,50.6 v16.51,52.07 14.97,53.61 U$2.P12
  Bottom 0.254: R27.1 15.24,53.77 15.24,53.34 v16.51,52.07
TMDS_CLKP  (via drill 0.6)
  Top 0.254: FPGA.P117 17.21,50.1 v16.51,50.8 13.97,53.34 U$2.P10
  Bottom 0.254: R27.2 14.61,53.27 14.61,52.7 v16.51,50.8
TMDS_D0N  (via drill 0.6)
  Top 0.254: FPGA.P118 16.44,49.6 v15.24,50.8 13.47,52.57 U$2.P9
  Bottom 0.254: R27.3 13.97,52.77 13.97,52.07 v15.24,50.8
TMDS_D0P  (via drill 0.6)
  Top 0.254: FPGA.P119 15.67,49.1 v15.24,49.53 12.47,52.3 U$2.P7
  Bottom 0.254: R27.4 13.34,52.28 13.34,51.44 v15.24,49.53
TMDS_D1N  (via drill 0.6)
  Top 0.254: FPGA.P120 14.9,48.6 v13.97,49.53 11.97,51.53 U$2.P6
  Bottom 0.254: R28.1 12.49,50.16 13.34,50.16 v13.97,49.53
TMDS_D1P  (via drill 0.6)
  Top 0.254: FPGA.P121 14.13,48.1 v13.97,48.26 10.97,51.26 U$2.P4
  Bottom 0.254: R28.2 12,49.53 12.7,49.53 v13.97,48.26
TMDS_D2N  (via drill 0.6)
  Top 0.254: FPGA.P123 13.86,47.1 v12.7,48.26 10.47,50.49 U$2.P3
  Bottom 0.254: R28.3 12.13,48.26 v12.7,48.26
TMDS_D2P  (via drill 0.6)
  Top 0.254: FPGA.P124 13.09,46.6 v12.7,46.99 9.47,50.22 U$2.P1
  Bottom 0.254: R28.4 12.27,46.99 v12.7,46.99
TMS/SWDIO  (via drill 0.6)
  Top 0.254: MCU.72 63.76,37.84 65.41,36.2 v69.85,36.2
  Bottom 0.254: JTAG.7 71.75,38.1 v69.85,36.2
USB_EN  (via drill 0.6)
  Top 0.254: v61.59,27.3 61.59,28.57 62.26,29.24 MCU.69 | 57.47,27.84 57.37,27.94 | R25.1 57.78,28.16 v57.78,29.21
  Top 0.406: MIC5219-5.0YM5.3 57.47,27.84 R25.1
  Bottom 0.254: v57.78,29.21 59.69,27.3 v61.59,27.3
USB_VBUS
  Top 0.254: MIC5219-5.0YM5.5 59.4,20.32 59.69,20.32 60.33,20.95 60.33,28.57 61.76,30.01 MCU.68
  Top 0.406: C3.1 C4.1 54.19,15.66 56.1,13.75 59.37,13.75 | MIC5219-5.0YM5.5 59.37,13.75 | 59.37,13.75 X1.VBUS
V+  (via drill 0.6, 1.4)
  Top 0.406: MIC5219-3.3YM5_1.1 91.12,50.06 R7.2 | C14.1 98,52.49 98.42,52.07 | MIC5219-5.0YM5.1 59.37,25.09 v59.05,25.4 59.05,27.73 R25.2 | R23.2 31.65,71.44 MIC5219-5.0YM1.1 | R8.2 32.28,65.09 MIC5219-3.3YM5_2.1 | C10.1 45.2,74.93 NCP565ST12T3G.3
  Top 0.61: R23.2 31.84,71.63 34.29,71.63 | C6.1 34.29,75.56 34.29,76.2 | R8.2 32.8,65.19 34.29,66.67 34.29,67.31 | C15.1 34.51,69.64 34.29,69.85 | C31.1 92.71,39.37
  Top 0.813: 92.71,50.16 R7.2
  Top 1.016: 53.85,77.47 D1.C 95.25,77.47 98.42,74.3 98.42,52.07 98.42,50.8 97.79,50.16 92.71,50.16 92.71,39.37 92.71,25.4 | 53.85,77.47 44.96,77.47 | 44.96,77.47 35.56,77.47 34.29,76.2 34.29,71.63 34.29,69.85 34.29,67.31 | 92.71,25.4 92.71,17.78 91.44,16.51 v91.44,6.35 | NCP565ST12T3G.3 44.96,77.47 | C47.1 92.71,25.4 | C48.1 53.85,77.47
  Bottom 0.406: C5.1 v59.05,25.4
  Bottom 0.61: v59.05,25.4 59.05,14.61 67.31,6.35 v91.44,6.35
VCCINT  (via drill 0.6)
  Top 0.254: FPGA.P28 35.38,36.02 v35.56,36.2 35.56,39.37 40.29,44.1 FPGA.P52 | FPGA.P19 30.88,35.79 v30.48,36.2 | FPGA.P89 31.38,58.05 v31.75,58.42 | FPGA.P128 21.1,44.6 v21.59,45.09
  Top 0.406: C16.1 45.09,72.52 NCP565ST12T3G.2
  Top 0.61: v28.57,58.42 28.57,59.69 32.38,63.5 34.29,63.5 43.18,72.39 NCP565ST12T3G.2 | C16.1 47.41,68.16 C46.1
  Bottom 0.254: v30.48,36.2 v21.59,45.09 21.59,48.26 | 21.59,48.26 v31.75,58.42 32.17,58 C32.1 | v35.56,36.2 v30.48,36.2 | C17.1 28.16,36.2 v30.48,36.2 | 21.59,48.26 19.47,48.26 C23.1 | C40.1 28.57,58.2 v28.57,58.42
  Bottom 0.61: v28.57,58.42 v31.75,58.42
VCCIO  (via drill 0.6)
  Top 0.254: 17.14,5.17 17.14,3.57 SDRAM.1 22.63,3.57 C34.1 | SDRAM.3 17.14,5.17 | v20.32,25.4 19.65,24.73 SDRAM.27 19.29,24.37 17.78,22.86 17.78,13.97 | SDRAM.49 6.4,7.57 v6.35,7.62 4.23,7.62 C33.1 | SDRAM.43 6.66,12.37 v6.35,12.06 | FPGA.P4 23.38,36.31 v22.86,36.83 22.86,41.1 | FPGA.P20 31.38,32.27 v30.86,31.75 30.38,32.23 FPGA.P18 | FPGA.P31 36.88,36.14 v36.83,36.2 38.73,36.2 | 38.73,36.2 39.38,35.55 FPGA.P36 39.38,32.16 C36.1 | 38.73,36.2 38.73,39.1 | 38.73,39.1 FPGA.P42 | v22.86,60.96 24.38,59.44 FPGA.P103 24.38,52.32 22.86,50.8 22.86,47.6 | FPGA.P90 30.88,58.82 v31.75,59.69 32.88,58.56 FPGA.P86 | 22.86,41.1 22.86,44.1 | 22.86,44.1 22.86,46.1 | 22.86,47.6 FPGA.P122 | FPGA.P135 22.86,41.1 | FPGA.P129 22.86,44.1 | FPGA.P125 22.86,46.1 | FPGA.P76 37.88,54.83 v38.1,54.61 37.34,53.85 37.34,46.48 | 38.73,39.1 v38.73,40.13 | 22.86,47.6 22.86,46.1 | U$3.10 18.14,58.78 20.32,60.96 v22.86,60.96 | R34.2 R35.2 22.86,61.81 v22.86,60.96 | 17.14,5.17 16.51,5.17 16.51,7.62 17.78,8.89 | 17.78,8.89 17.78,13.97 | 17.78,13.97 SDRAM.14 | SDRAM.9 18.86,9.97 17.78,8.89 | FPGA.P63 40.71,49.6 37.59,46.48 37.34,46.48 | FPGA.P53 39.22,44.6 37.34,46.48
  Top 0.406: MIC5219-3.3YM5_2.5 27.09,64.91 C13.1 24.77,62.87 v22.86,60.96
  Bottom 0.254: v6.35,7.62 v6.35,12.06 6.99,12.06 v20.32,25.4 | v20.32,25.4 20.32,34.29 v22.86,36.83 | v36.83,36.2 36.83,35.56 33.02,31.75 v30.86,31.75 27.94,31.75 v22.86,36.83 | FPGA_JTAG.2 18.13,65.69 v22.86,60.96 24.13,59.69 v31.75,59.69 33.02,59.69 v38.1,54.61 C39.1 | 13.76,55.24 R27.8 R27.7 R27.6 R27.5 R28.8 R28.7 R28.6 R28.5 | R28.5 8.87,48.28 20.32,36.83 v22.86,36.83 | C35.1 16.93,25.4 v20.32,25.4 | C37.1 8.86,50.38 R28.5 | v22.86,36.83 24.13,38.1 C12.1 | C38.1 38.99,39.88 v38.73,40.13
VSYNC
  Top 0.254: MCU.35 49.09,48.06 46.06,51.1 42.88,51.1 42.55,51.1 FPGA.P66

## Text on the board
Top: {Gator Vision}
Bottom: Jeff Theusch / Rev A, Jan 2013